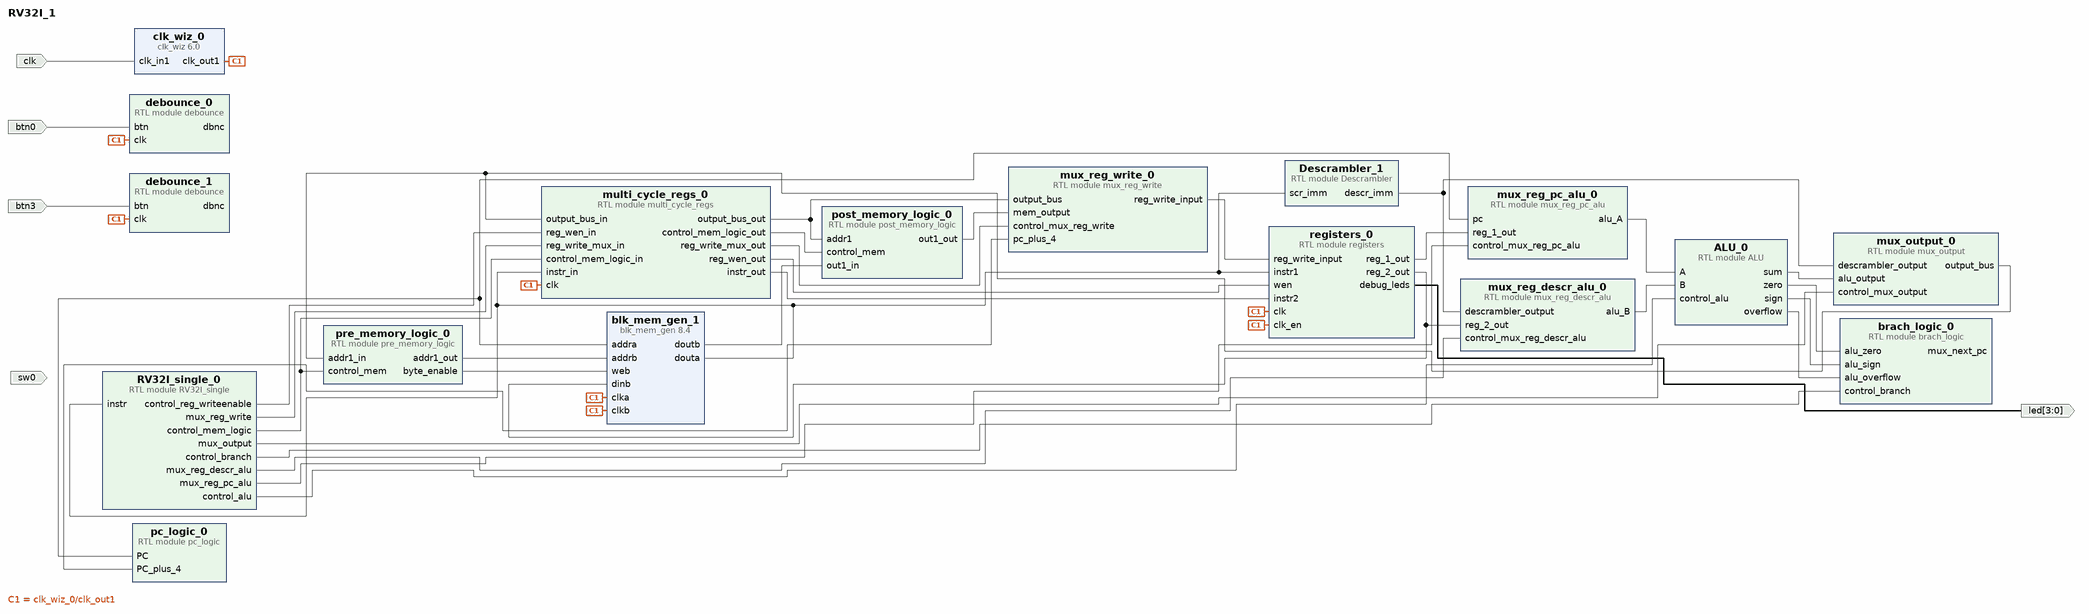
[diagram p0: block diagram of the top level]
# Vivado block design RV32I_1, xc7z010clg400-1, Vivado 2018.3
create_bd_design RV32I_1

create_bd_port -dir I -type clk clk
set_property -dict {CONFIG.FREQ_HZ 125000000} [get_bd_ports clk]
create_bd_port -dir O -from 3 -to 0 led
create_bd_port -dir I -type rst btn3
create_bd_port -dir I sw0
create_bd_port -dir I btn0

create_bd_cell -type module -reference Descrambler Descrambler_1
create_bd_cell -type module -reference ALU ALU_0
create_bd_cell -type module -reference brach_logic brach_logic_0
create_bd_cell -type module -reference mux_output mux_output_0
create_bd_cell -type module -reference mux_reg_descr_alu mux_reg_descr_alu_0
create_bd_cell -type module -reference mux_reg_pc_alu mux_reg_pc_alu_0
create_bd_cell -type module -reference mux_reg_write mux_reg_write_0
create_bd_cell -type module -reference pre_memory_logic pre_memory_logic_0
create_bd_cell -type module -reference post_memory_logic post_memory_logic_0
create_bd_cell -type module -reference debounce debounce_0
create_bd_cell -type module -reference debounce debounce_1
create_bd_cell -type ip -vlnv xilinx.com:ip:blk_mem_gen:8.4 blk_mem_gen_1
set_property -dict [list \
  CONFIG.Assume_Synchronous_Clk false \
  CONFIG.Byte_Size 8 \
  CONFIG.Coe_File ../../../../../../../../Dumps_and_Assembly/Dumps/addTest_Dump.coe \
  CONFIG.Enable_32bit_Address false \
  CONFIG.Enable_A Always_Enabled \
  CONFIG.Enable_B Always_Enabled \
  CONFIG.Fill_Remaining_Memory_Locations true \
  CONFIG.Load_Init_File true \
  CONFIG.Memory_Type True_Dual_Port_RAM \
  CONFIG.Operating_Mode_A WRITE_FIRST \
  CONFIG.Port_B_Clock 100 \
  CONFIG.Port_B_Enable_Rate 100 \
  CONFIG.Port_B_Write_Rate 50 \
  CONFIG.Read_Width_A 32 \
  CONFIG.Read_Width_B 32 \
  CONFIG.Register_PortA_Output_of_Memory_Primitives false \
  CONFIG.Register_PortB_Output_of_Memory_Primitives false \
  CONFIG.Use_Byte_Write_Enable true \
  CONFIG.Use_RSTA_Pin false \
  CONFIG.Use_RSTB_Pin false \
  CONFIG.Write_Depth_A 4096 \
  CONFIG.Write_Width_A 32 \
  CONFIG.Write_Width_B 32 \
  CONFIG.use_bram_block Stand_Alone \
] [get_bd_cells blk_mem_gen_1]
create_bd_cell -type module -reference registers registers_0
create_bd_cell -type module -reference RV32I_single RV32I_single_0
create_bd_cell -type ip -vlnv xilinx.com:ip:clk_wiz:6.0 clk_wiz_0
set_property -dict [list \
  CONFIG.CLKIN1_JITTER_PS 80.0 \
  CONFIG.CLKOUT1_DRIVES BUFG \
  CONFIG.CLKOUT1_JITTER 394.794 \
  CONFIG.CLKOUT1_PHASE_ERROR 258.220 \
  CONFIG.CLKOUT1_REQUESTED_OUT_FREQ 10.000 \
  CONFIG.CLKOUT2_DRIVES BUFG \
  CONFIG.CLKOUT3_DRIVES BUFG \
  CONFIG.CLKOUT4_DRIVES BUFG \
  CONFIG.CLKOUT5_DRIVES BUFG \
  CONFIG.CLKOUT6_DRIVES BUFG \
  CONFIG.CLKOUT7_DRIVES BUFG \
  CONFIG.MMCM_CLKFBOUT_MULT_F 34 \
  CONFIG.MMCM_CLKIN1_PERIOD 8.000 \
  CONFIG.MMCM_CLKIN2_PERIOD 10.0 \
  CONFIG.MMCM_CLKOUT0_DIVIDE_F 85 \
  CONFIG.MMCM_COMPENSATION ZHOLD \
  CONFIG.MMCM_DIVCLK_DIVIDE 5 \
  CONFIG.PRIMITIVE PLL \
  CONFIG.PRIM_IN_FREQ 125.000 \
  CONFIG.USE_LOCKED false \
  CONFIG.USE_RESET false \
] [get_bd_cells clk_wiz_0]
create_bd_cell -type module -reference pc_logic pc_logic_0
create_bd_cell -type module -reference multi_cycle_regs multi_cycle_regs_0

# ---- connections ----

connect_bd_net -net memory_0_instr [get_bd_pins blk_mem_gen_1/douta] \
  [get_bd_pins Descrambler_1/scr_imm] [get_bd_pins registers_0/instr1] [get_bd_pins RV32I_single_0/instr] \
  [get_bd_pins multi_cycle_regs_0/instr_in]
connect_bd_net [get_bd_pins RV32I_single_0/control_mem_logic] \
  [get_bd_pins pre_memory_logic_0/control_mem] [get_bd_pins multi_cycle_regs_0/control_mem_logic_in]
connect_bd_net -net pc_logic_0_pc [get_bd_pins mux_reg_pc_alu_0/pc] [get_bd_pins blk_mem_gen_1/addra] [get_bd_pins pc_logic_0/PC]
connect_bd_net [get_bd_pins RV32I_single_0/mux_output] [get_bd_pins mux_output_0/control_mux_output]
connect_bd_net [get_bd_pins Descrambler_1/descr_imm] \
  [get_bd_pins mux_output_0/descrambler_output] [get_bd_pins mux_reg_descr_alu_0/descrambler_output]
connect_bd_net [get_bd_pins ALU_0/sum] [get_bd_pins mux_output_0/alu_output]
connect_bd_net [get_bd_pins ALU_0/zero] [get_bd_pins brach_logic_0/alu_zero]
connect_bd_net [get_bd_pins ALU_0/sign] [get_bd_pins brach_logic_0/alu_sign]
connect_bd_net [get_bd_pins ALU_0/overflow] [get_bd_pins brach_logic_0/alu_overflow]
connect_bd_net [get_bd_pins RV32I_single_0/control_branch] [get_bd_pins brach_logic_0/control_branch]
connect_bd_net [get_bd_pins registers_0/reg_1_out] [get_bd_pins mux_reg_pc_alu_0/reg_1_out]
connect_bd_net [get_bd_pins mux_reg_pc_alu_0/alu_A] [get_bd_pins ALU_0/A]
connect_bd_net [get_bd_pins mux_reg_descr_alu_0/alu_B] [get_bd_pins ALU_0/B]
connect_bd_net [get_bd_pins RV32I_single_0/mux_reg_descr_alu] [get_bd_pins mux_reg_descr_alu_0/control_mux_reg_descr_alu]
connect_bd_net [get_bd_pins RV32I_single_0/mux_reg_pc_alu] [get_bd_pins mux_reg_pc_alu_0/control_mux_reg_pc_alu]
connect_bd_net [get_bd_pins RV32I_single_0/control_alu] [get_bd_pins ALU_0/control_alu]
# net brach_logic_0_mux_next_pc has one end: brach_logic_0/mux_next_pc
connect_bd_net -net mux_output_0_output_bus [get_bd_pins multi_cycle_regs_0/output_bus_out] \
  [get_bd_pins mux_reg_write_0/output_bus] [get_bd_pins post_memory_logic_0/addr1]
connect_bd_net [get_bd_pins post_memory_logic_0/out1_out] [get_bd_pins mux_reg_write_0/mem_output]
connect_bd_net -net pc_logic_0_pc_plus_4 [get_bd_pins mux_reg_write_0/pc_plus_4] [get_bd_pins pc_logic_0/PC_plus_4]
connect_bd_net [get_bd_pins mux_reg_write_0/reg_write_input] [get_bd_pins registers_0/reg_write_input]
connect_bd_net [get_bd_pins registers_0/reg_2_out] [get_bd_pins mux_reg_descr_alu_0/reg_2_out] [get_bd_pins blk_mem_gen_1/dinb]
connect_bd_net [get_bd_pins registers_0/debug_leds] [get_bd_ports led]
connect_bd_net -net rst_0_1 [get_bd_ports btn3] [get_bd_pins debounce_1/btn]
# net debug_enable_0_1 has one end: sw0
connect_bd_net -net debug_next_instr_0_1 [get_bd_ports btn0] [get_bd_pins debounce_0/btn]
# net debounce_0_dbnc has one end: debounce_0/dbnc
# net debounce_1_dbnc has one end: debounce_1/dbnc
connect_bd_net [get_bd_pins pre_memory_logic_0/addr1_out] [get_bd_pins blk_mem_gen_1/addrb]
connect_bd_net [get_bd_pins pre_memory_logic_0/byte_enable] [get_bd_pins blk_mem_gen_1/web]
connect_bd_net [get_bd_pins blk_mem_gen_1/doutb] [get_bd_pins post_memory_logic_0/out1_in]
connect_bd_net [get_bd_pins RV32I_single_0/control_reg_writeenable] [get_bd_pins multi_cycle_regs_0/reg_wen_in]
connect_bd_net [get_bd_pins multi_cycle_regs_0/reg_wen_out] [get_bd_pins registers_0/wen]
connect_bd_net [get_bd_pins mux_output_0/output_bus] [get_bd_pins pre_memory_logic_0/addr1_in] [get_bd_pins multi_cycle_regs_0/output_bus_in]
connect_bd_net [get_bd_pins multi_cycle_regs_0/control_mem_logic_out] [get_bd_pins post_memory_logic_0/control_mem]
connect_bd_net [get_bd_pins multi_cycle_regs_0/instr_out] [get_bd_pins registers_0/instr2]
connect_bd_net [get_bd_pins RV32I_single_0/mux_reg_write] [get_bd_pins multi_cycle_regs_0/reg_write_mux_in]
connect_bd_net [get_bd_pins multi_cycle_regs_0/reg_write_mux_out] [get_bd_pins mux_reg_write_0/control_mux_reg_write]
connect_bd_net [get_bd_ports clk] [get_bd_pins clk_wiz_0/clk_in1]
connect_bd_net [get_bd_pins clk_wiz_0/clk_out1] \
  [get_bd_pins blk_mem_gen_1/clka] [get_bd_pins blk_mem_gen_1/clkb] [get_bd_pins registers_0/clk] \
  [get_bd_pins registers_0/clk_en] [get_bd_pins debounce_1/clk] [get_bd_pins debounce_0/clk] \
  [get_bd_pins multi_cycle_regs_0/clk]

validate_bd_design
save_bd_design
